# EasyEDA Pro project Summer Robot.eprj, schematic Full Schematic

## Sheets
1 Control System: Create Date: 2025-12-27; Page Name: Control System; Project Name: Summer Robot; Schematic Name: Full Schematic; Update Date: 2026-01-06; Company: EasyEDA.com; Page Size: A4; Version: V1.0
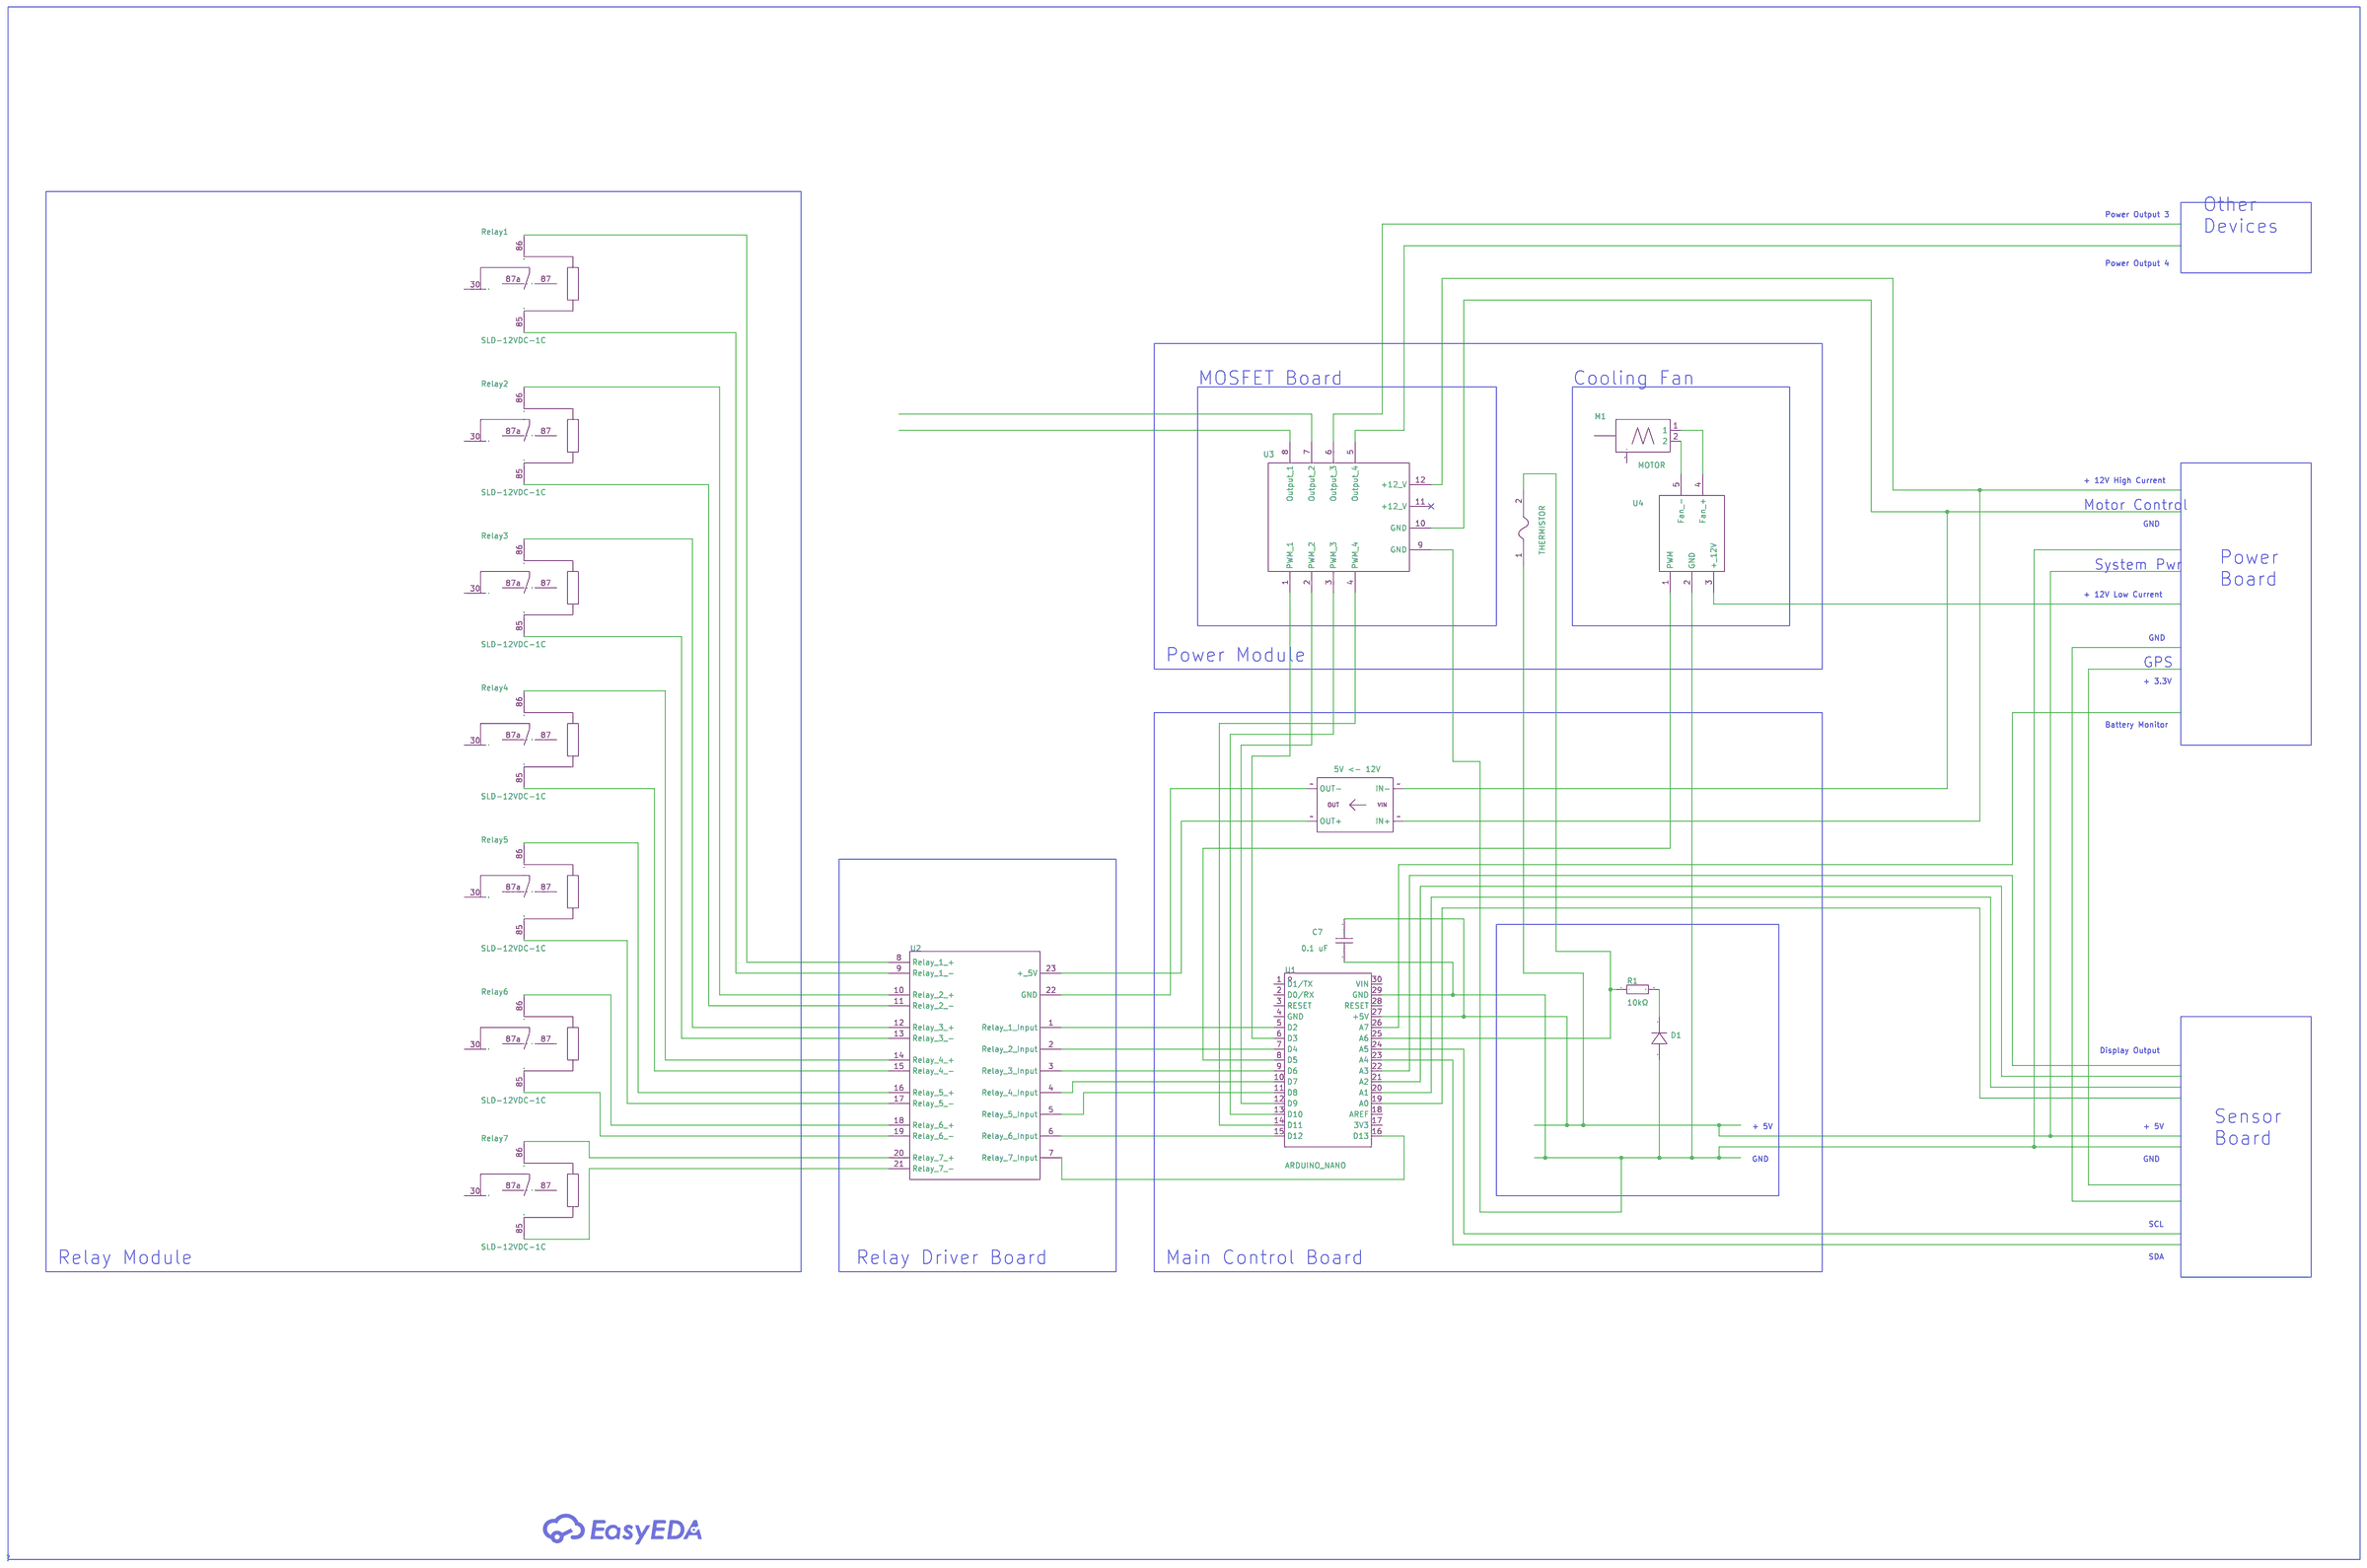
[diagram p4: Control System]
2 Sensor System: Create Date: 2025-12-28; Page Name: Sensor System; Update Date: 2026-06-13
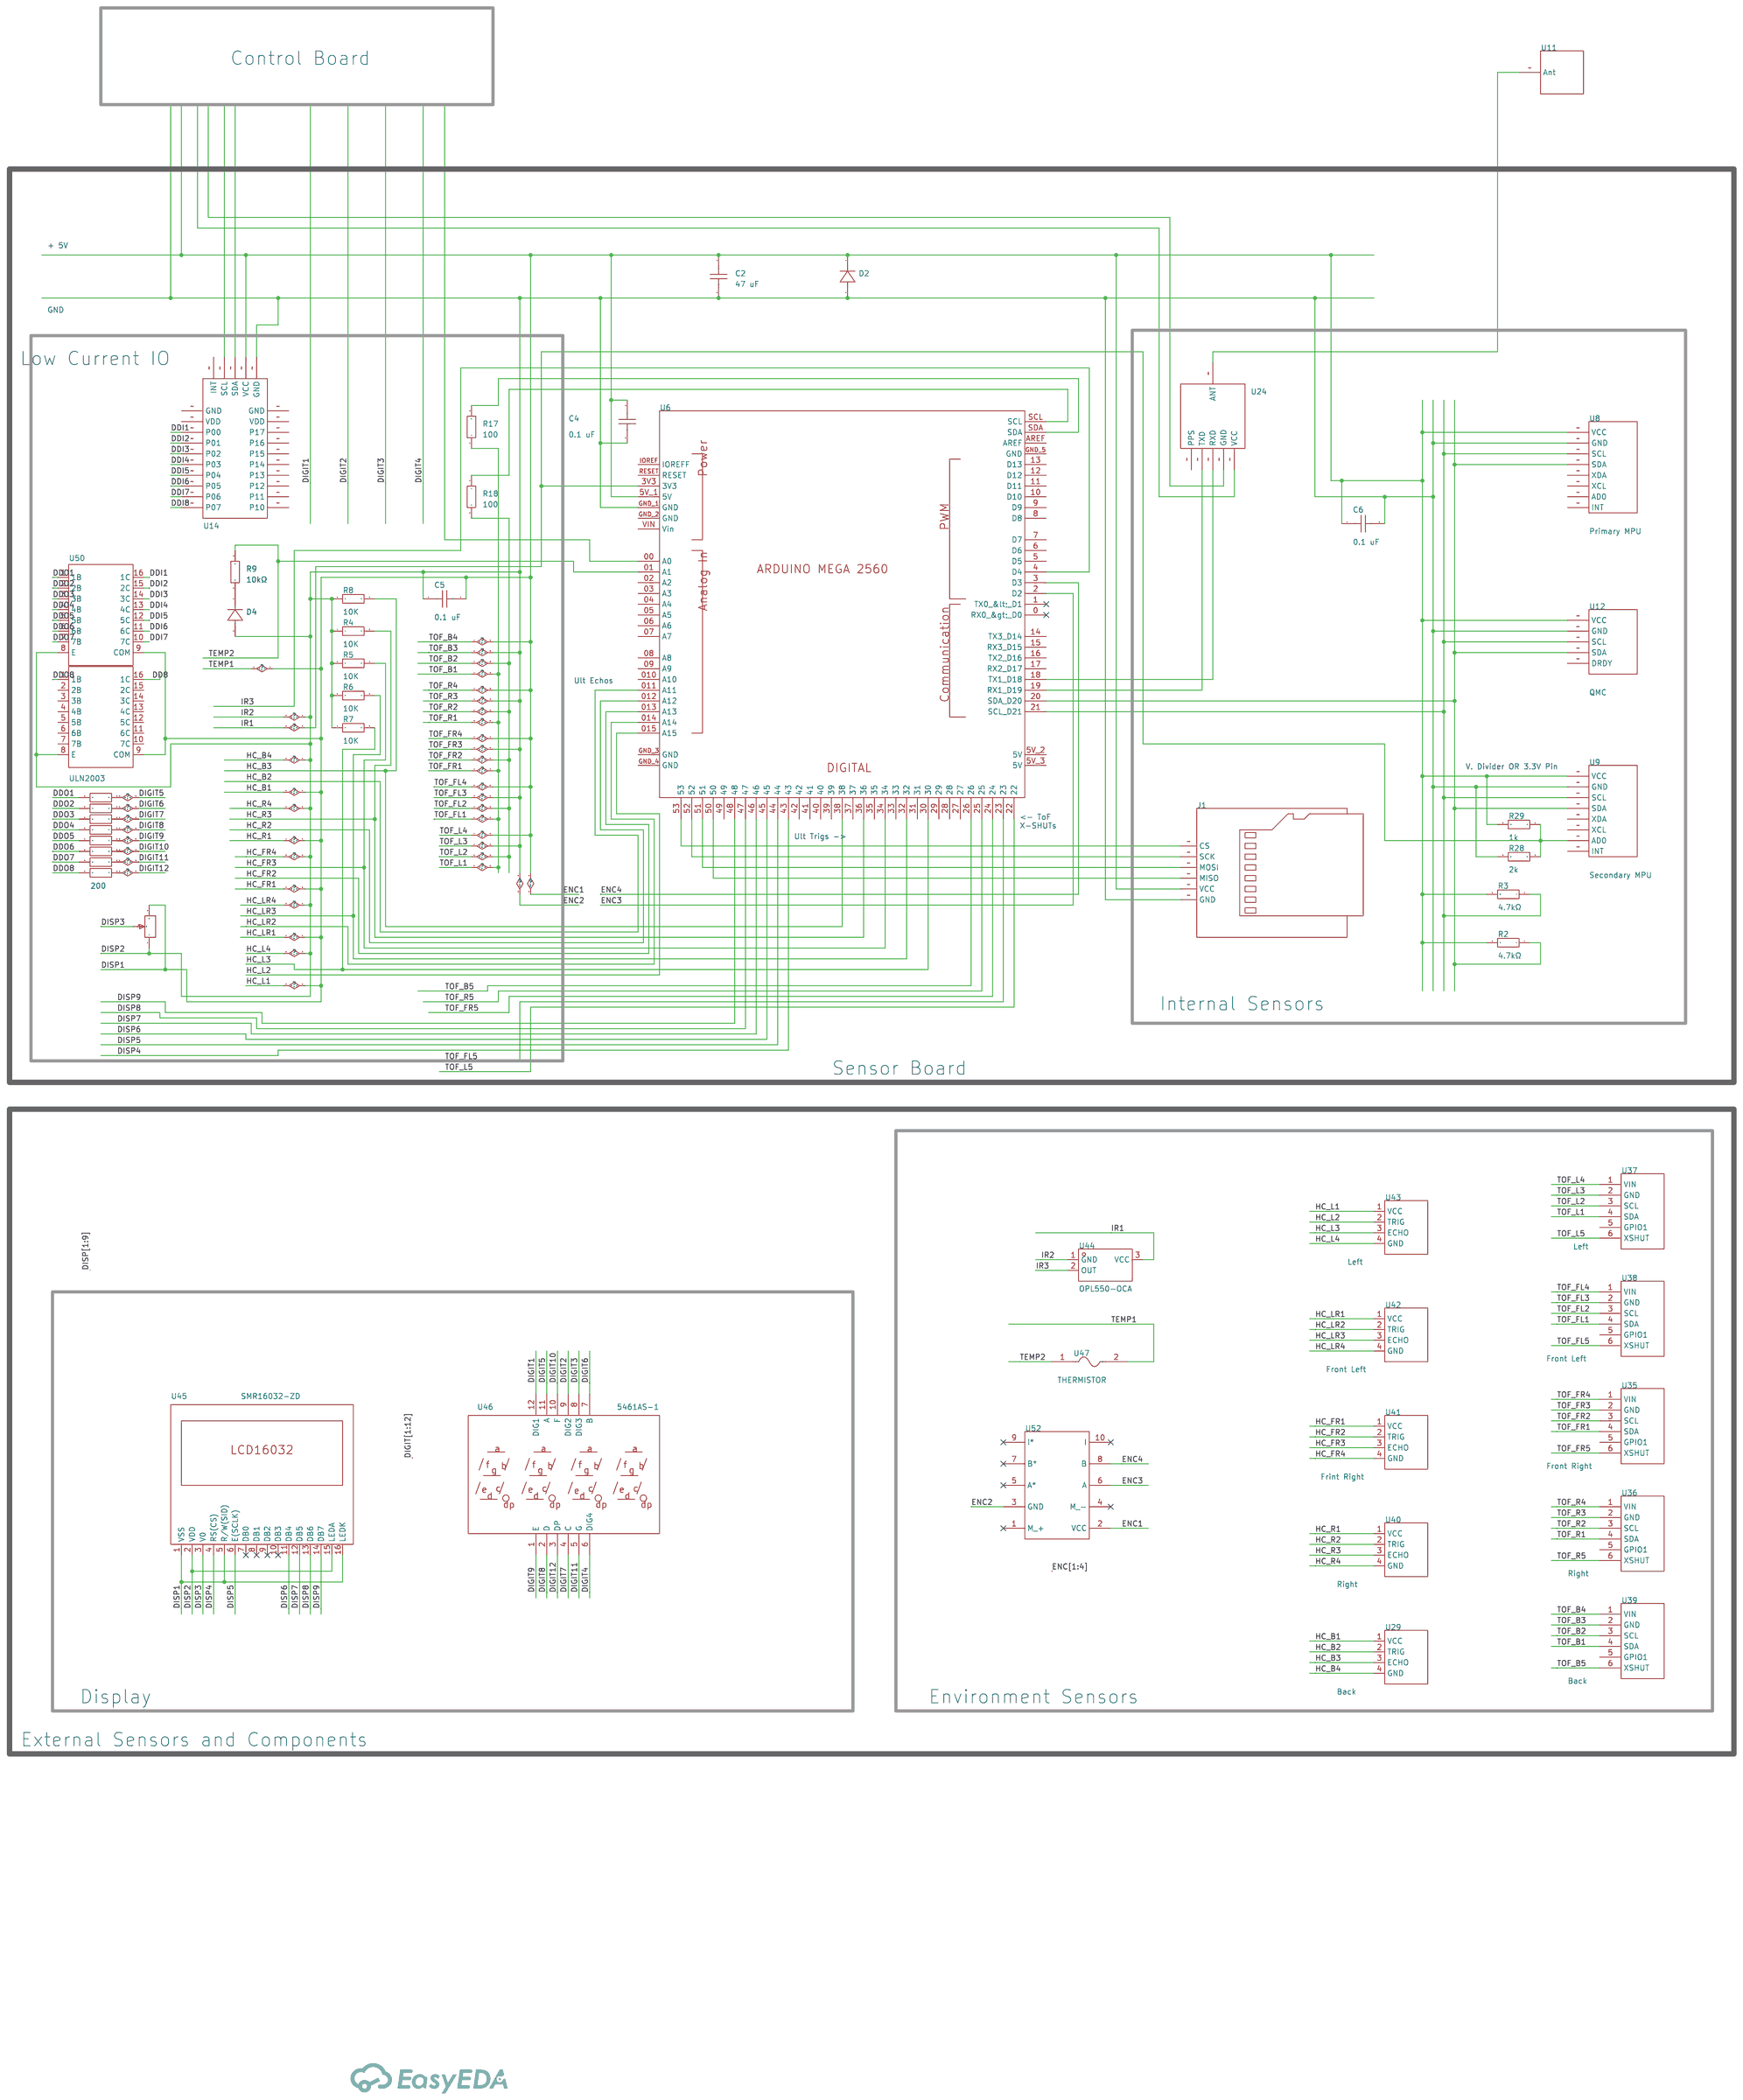
[diagram p5: Sensor System]
3 Power System: Create Date: 2025-12-28; Page Name: Power System; Update Date: 2026-06-14
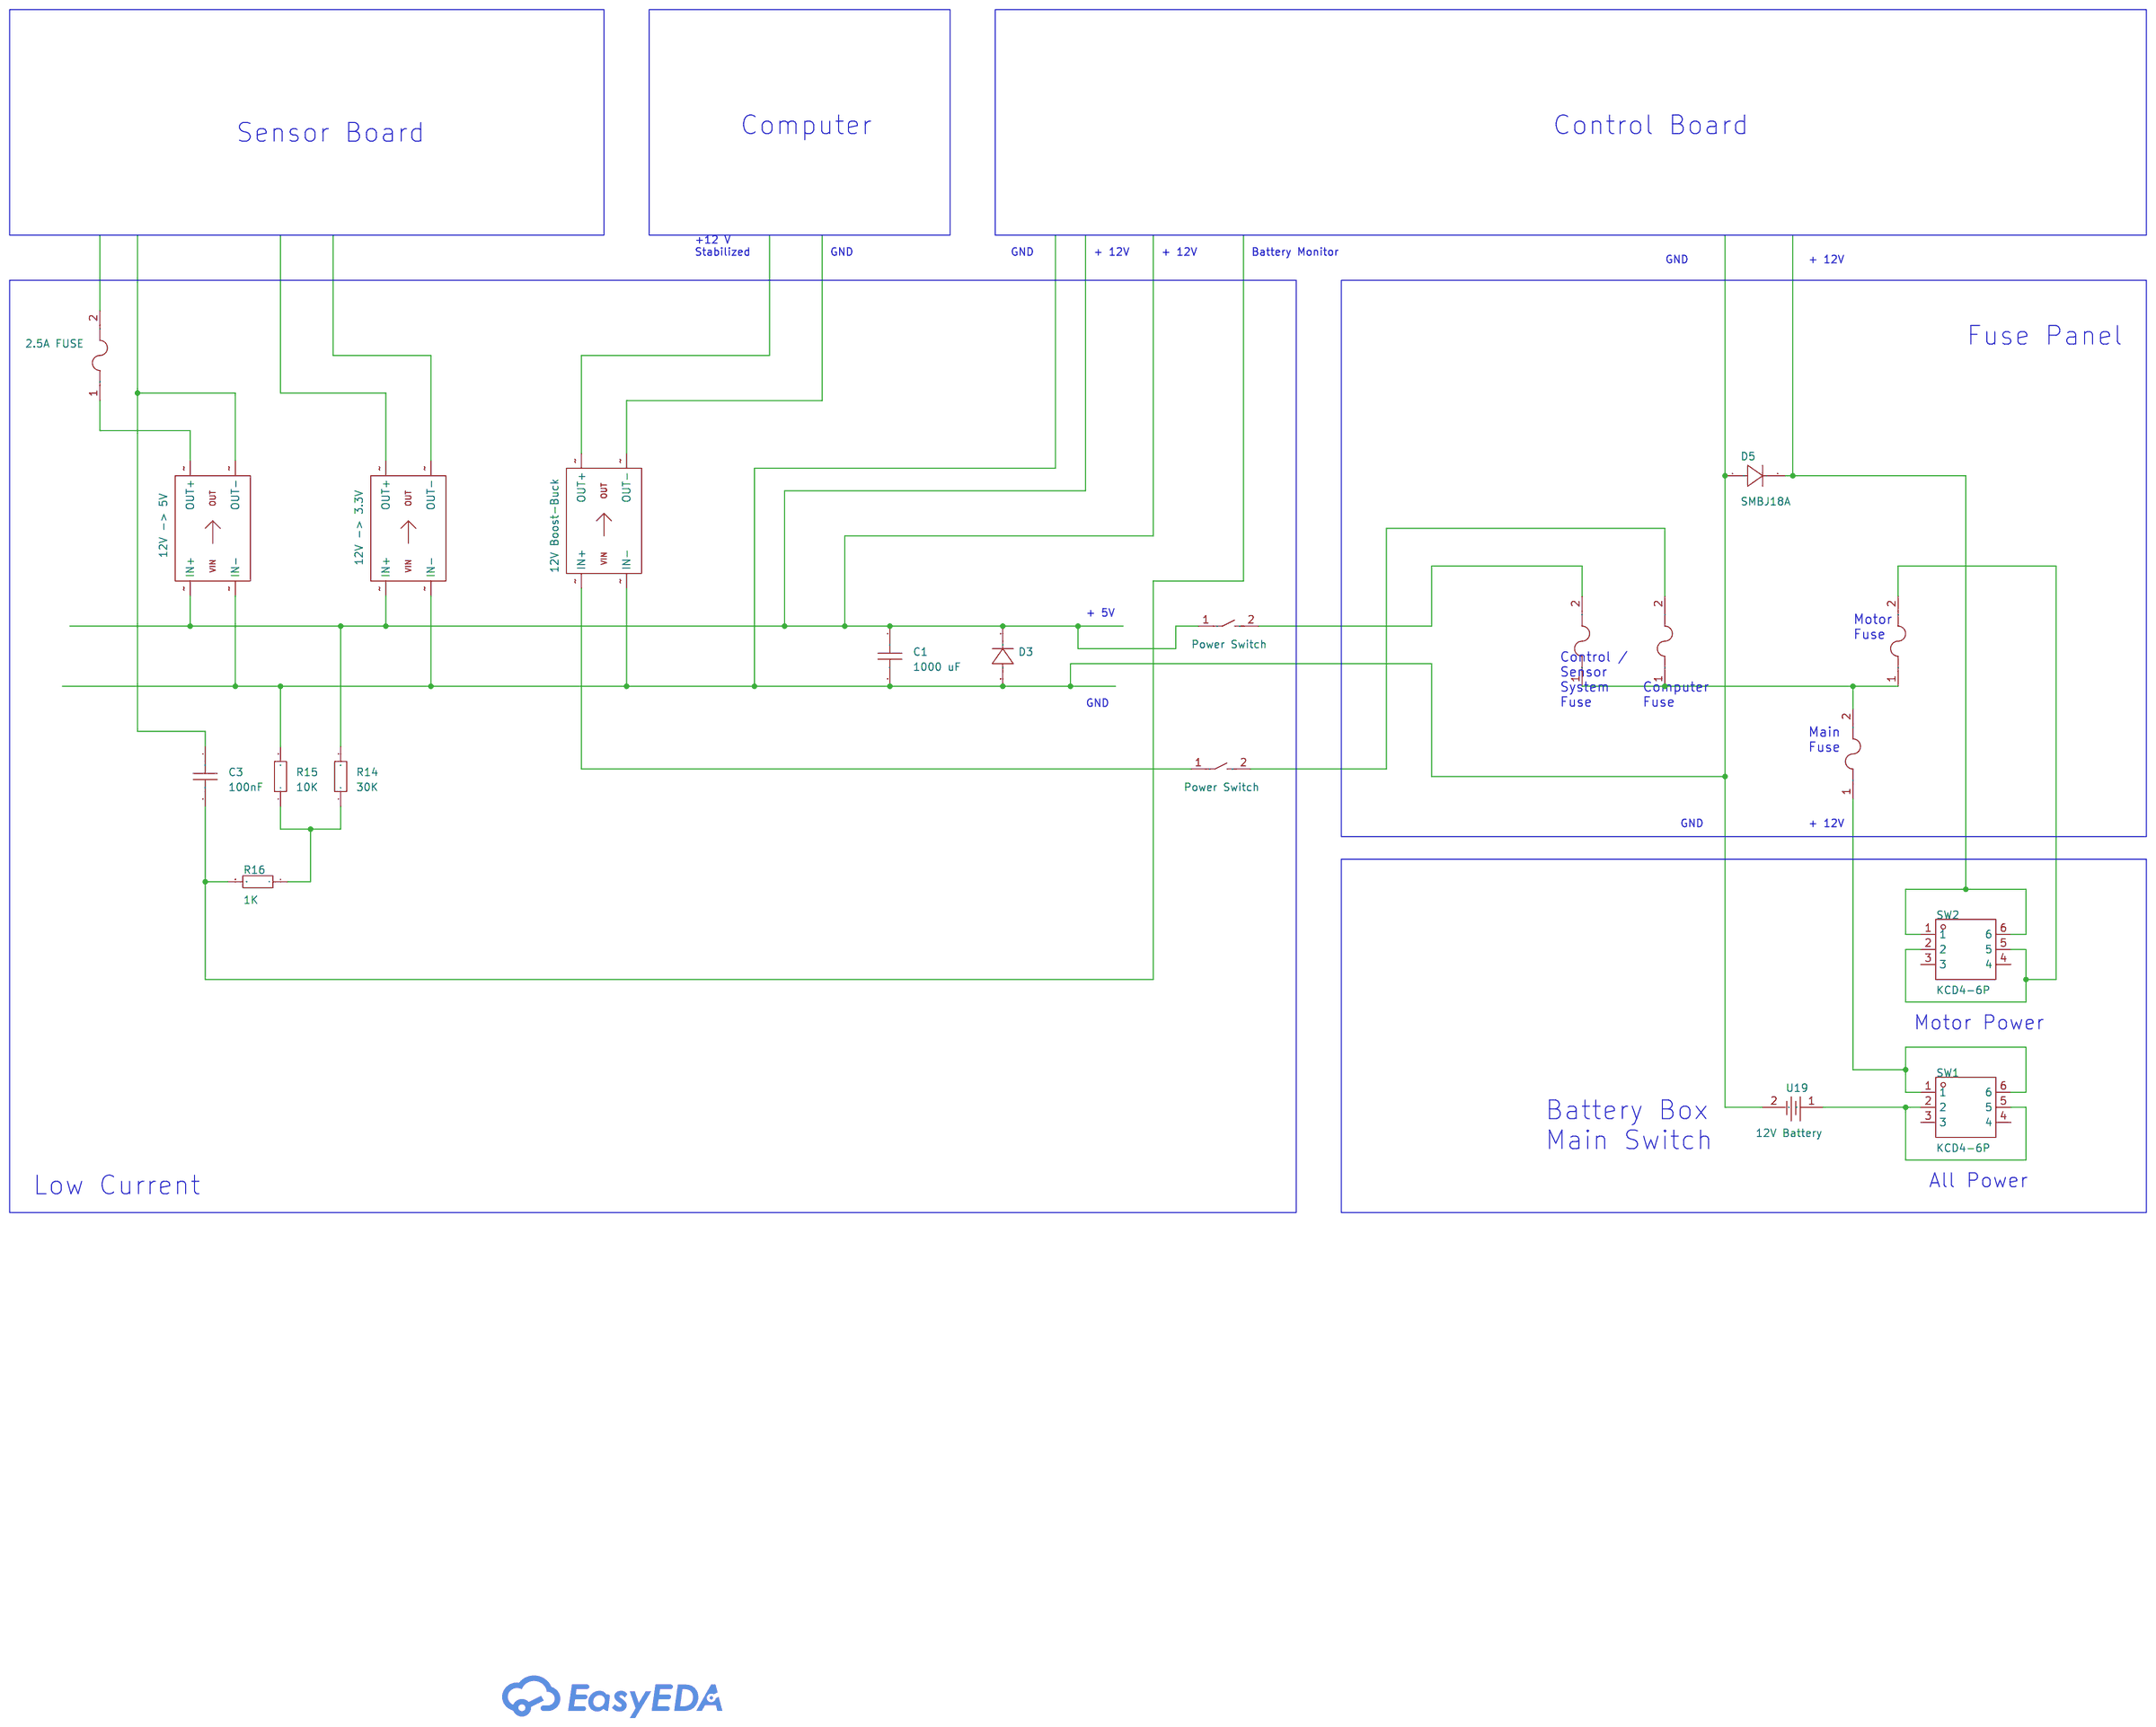
[diagram p6: Power System]
4 Computer: Create Date: 2025-12-28; Page Name: Computer; Update Date: 2025-12-28
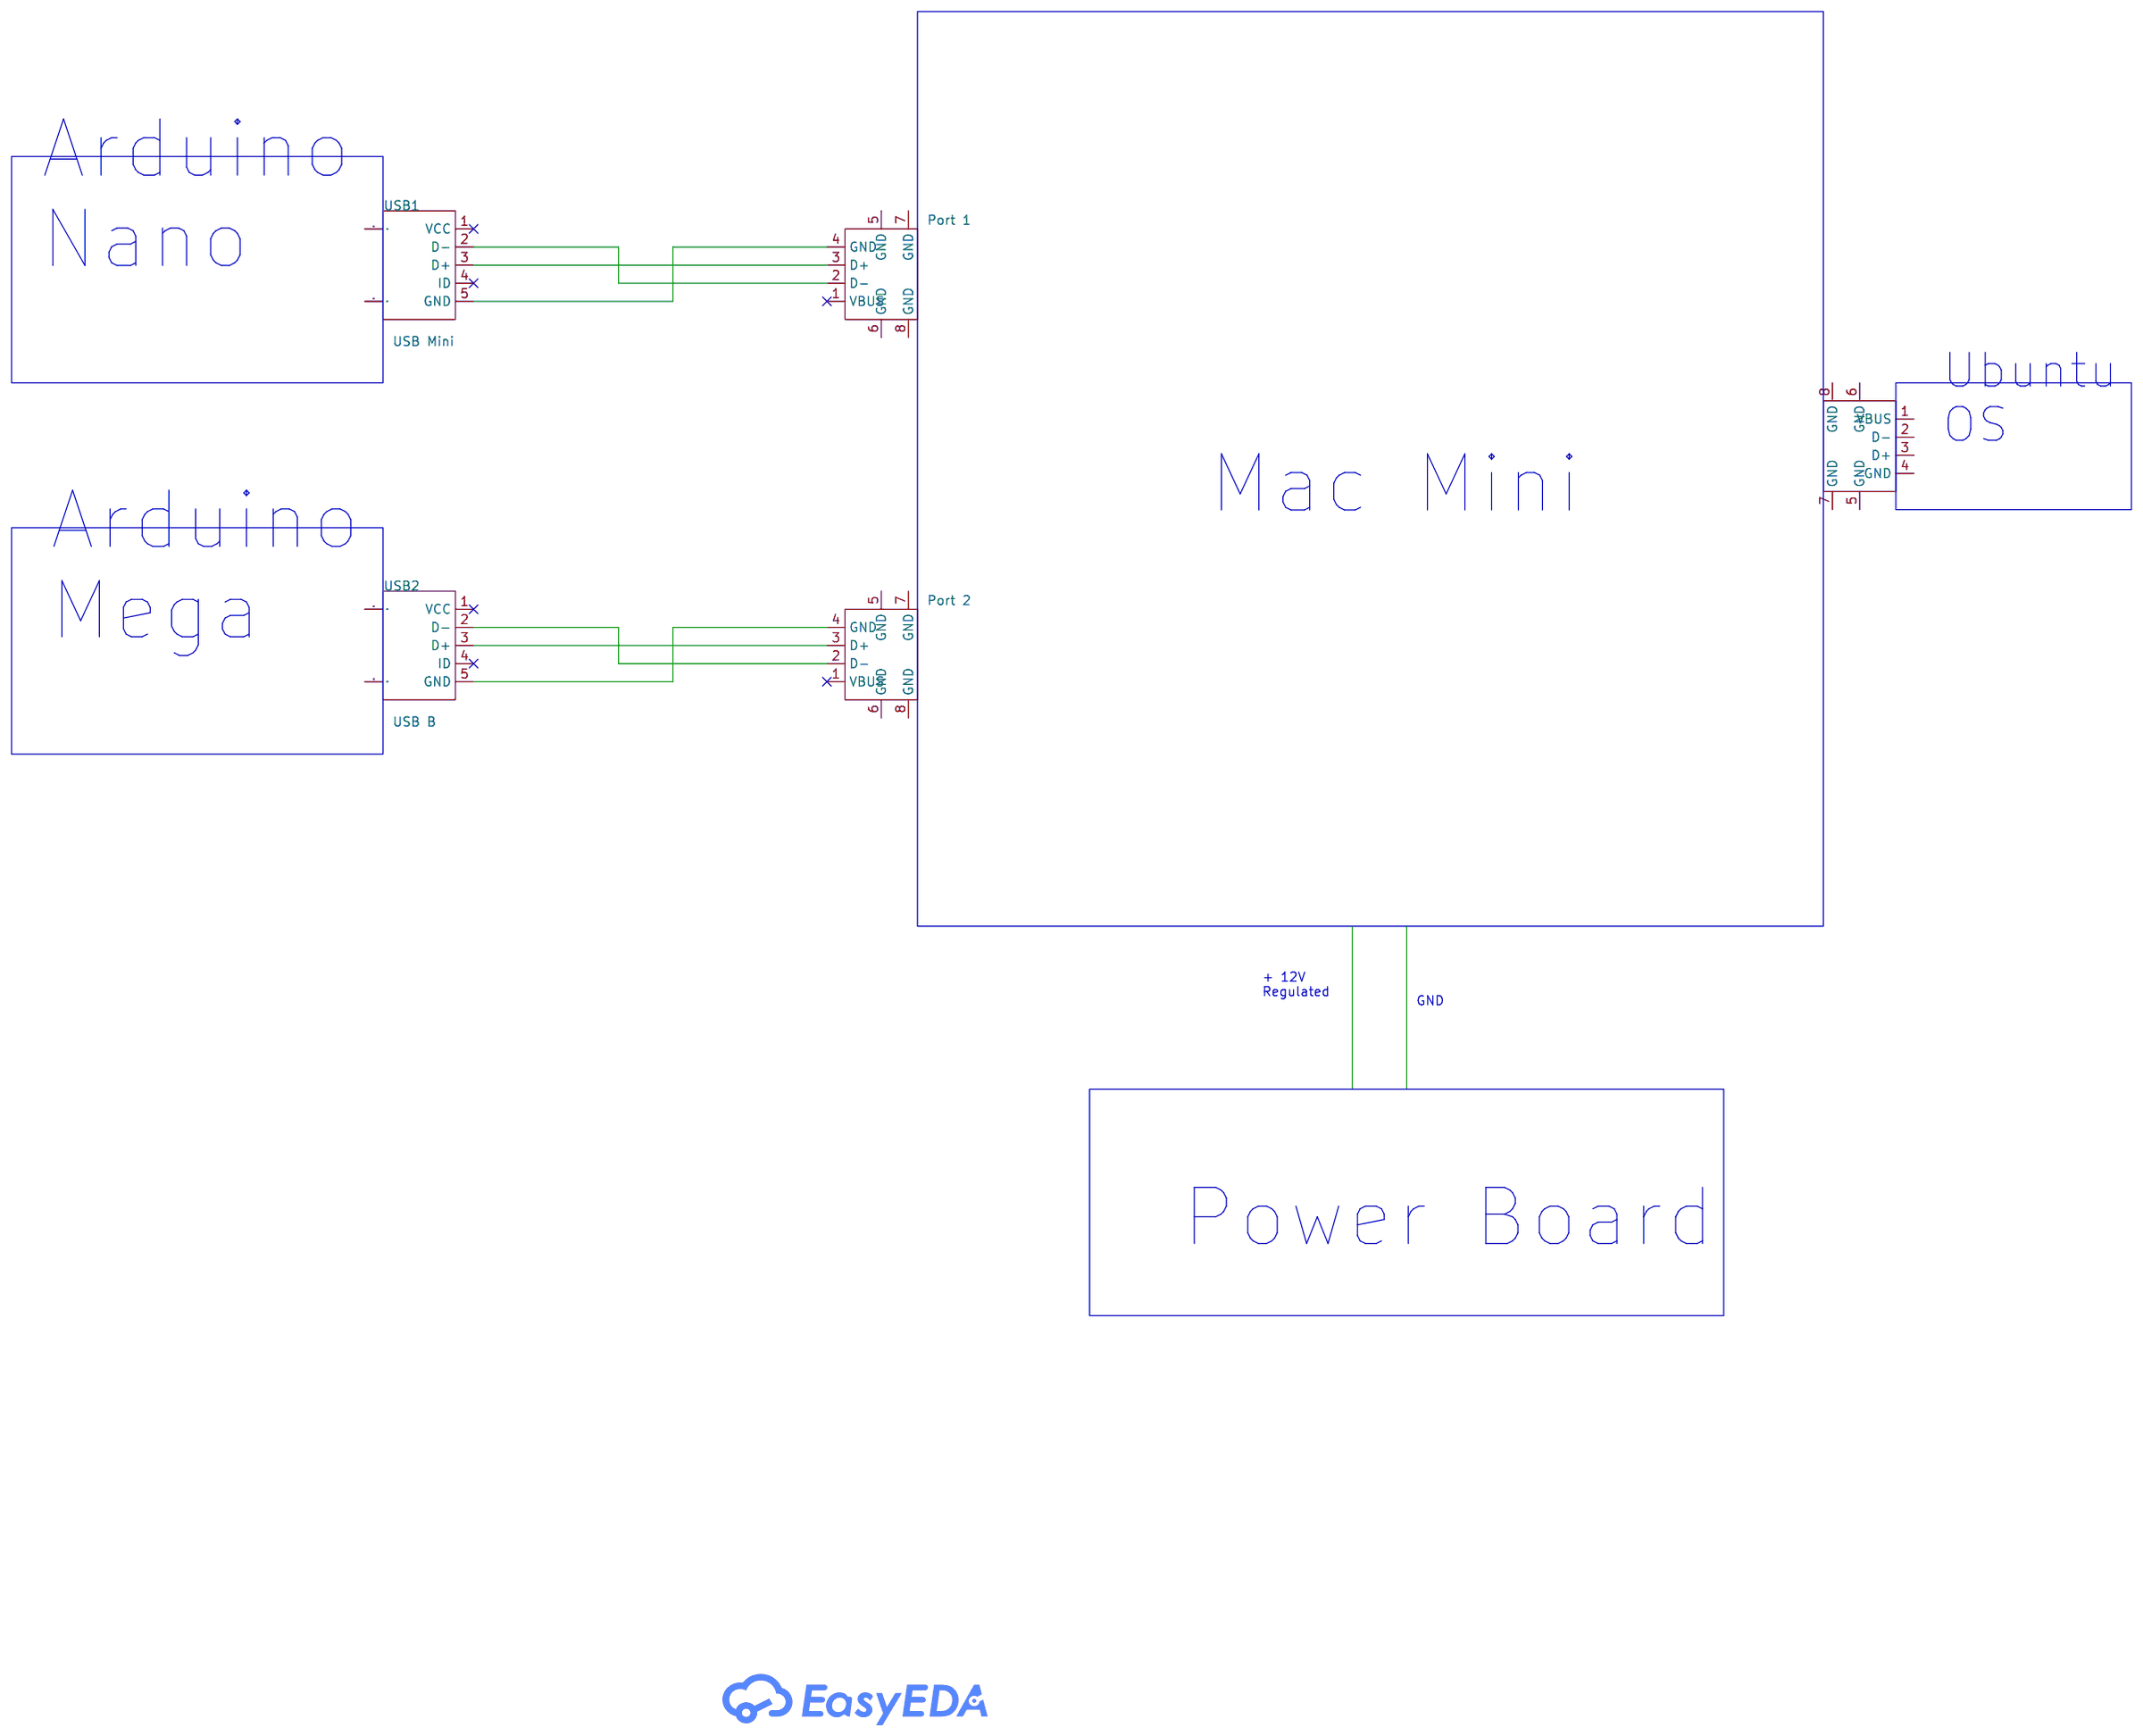
[diagram p7: Computer]

## Parts
sheet Computer
U21  Port 1  [USB-TH_3AR04S-31P0025GS]
U22  Port 2  [USB-TH_3AR04S-31P0025GS]
U23  3AR04S-31P0025GS  [USB-TH_3AR04S-31P0025GS]
USB1  USB Mini  [MINI-USB-SMD_MINI-5PTP]
USB2  USB B  [MINI-USB-SMD_MINI-5PTP]
sheet Control System
C7  0.1 uF  [C0603]
D1  -  [DO-41_BD2.4-L4.7-P8.70-D0.9-RD]
M1  MOTOR  [VIBRATING-MOTOR-SMD_3P_C9900012555]
R1  10kΩ  [RES-TH_BD1.8-L3.2-P7.20-D0.4]
Relay1  SLD-12VDC-1C  [RELAY-TH_SLD-12VDC-1C]
Relay2  SLD-12VDC-1C  [RELAY-TH_SLD-12VDC-1C]
Relay3  SLD-12VDC-1C  [RELAY-TH_SLD-12VDC-1C]
Relay4  SLD-12VDC-1C  [RELAY-TH_SLD-12VDC-1C]
Relay5  SLD-12VDC-1C  [RELAY-TH_SLD-12VDC-1C]
Relay6  SLD-12VDC-1C  [RELAY-TH_SLD-12VDC-1C]
Relay7  SLD-12VDC-1C  [RELAY-TH_SLD-12VDC-1C]
U1  ARDUINO_NANO  [COMM-TH_ARDUINO_NANO]
U2  -
U3  Low Side Power Control
U4  Fan Control
U5  THERMISTOR  [FUSE-SMD_L7.3-W5.1-1]
U7  DC_Step_Down
sheet Power System
C1  1000 uF  [C0603]
C3  100nF  [C0603]
D3  -  [SMA_L4.4-W2.8-LS5.4-RD]
D5  SMBJ18A  [SMB_L4.6-W3.6-LS5.3-RD]
R14  30K  [R0603]
R15  10K  [R0603]
R16  1K  [R0603]
S1  Power Switch  [KEY-SMD_L6.0-W3.5-LS8.0-1]
S2  Power Switch  [KEY-SMD_L6.0-W3.5-LS8.0-1]
SW1  KCD4-6P  [SW-TH_HX-KCD4-6P]
SW2  KCD4-6P  [SW-TH_HX-KCD4-6P]
U15  DC_Step_Down
U16  DC_Step_Down
U17  DC_Step_Down
U19  12V Battery  [BAT-SMD_DIANCHI2]
U53  2.5A FUSE  [FUSE-TH_L7.4-W4.5-P5.10-D0.6-S4.50]
U54  JK250-040U  [FUSE-TH_L7.4-W4.5-P5.10-D0.6-S4.50]
U55  JK250-040U  [FUSE-TH_L7.4-W4.5-P5.10-D0.6-S4.50]
U56  JK250-040U  [FUSE-TH_L7.4-W4.5-P5.10-D0.6-S4.50]
U57  JK250-040U  [FUSE-TH_L7.4-W4.5-P5.10-D0.6-S4.50]
sheet Sensor System
C2  47 uF  [C0603]
C4  0.1 uF  [C0603]
C5  0.1 uF  [C0603]
C6  0.1 uF  [C0603]
D2  -  [SMA_L4.4-W2.8-LS5.4-RD]
D4  -  [DO-41_BD2.4-L4.7-P8.70-D0.9-RD]
J1  Micro_SD_Card_SPI_Adapter
R2  4.7kΩ  [RES-TH_BD1.8-L3.2-P7.20-D0.4]
R3  4.7kΩ  [RES-TH_BD1.8-L3.2-P7.20-D0.4]
R4  10K  [R0603]
R5  10K  [R0603]
R6  10K  [R0603]
R7  10K  [R0603]
R8  10K  [R0603]
R9  10kΩ  [RES-TH_BD1.8-L3.2-P7.20-D0.4]
R17  100  [R0603]
R18  100  [R0603]
R19  200  [R0603]
R21  200  [R0603]
R22  200  [R0603]
R23  200  [R0603]
R24  200  [R0603]
R25  200  [R0603]
R26  200  [R0603]
R27  200  [R0603]
R28  2k  [RES-TH_BD1.8-L3.2-P7.20-D0.4]
R29  1k  [RES-TH_BD1.8-L3.2-P7.20-D0.4]
U6  -
U8  MPU6050
U9  MPU6050
U11  GPS_Ant
U12  QMC5883L
U14  PCF8575
U24  NEO-6M
U29  Back  [TH_HC-SR04V]
U35  Front Right
U36  Right
U37  Left
U38  Front Left
U39  Back
U40  Right  [TH_HC-SR04V]
U41  Frint Right  [TH_HC-SR04V]
U42  Front Left  [TH_HC-SR04V]
U43  Left  [TH_HC-SR04V]
U44  OPL550-OCA  [OPTO-TH_3P-L4.5-W2.4-P1.91-D0.6]
U45  SMR16032-ZD  [LCD-TH_SMR16032-ZD]
U46  5461AS-1  [LED-SEG-TH_12P-L50.4-W19.0-P2.54-S15.24-BL]
U47  THERMISTOR  [FUSE-SMD_L7.3-W5.1-1]
U48  3*3Potentiometer-10kΩ20%  [RES-ADJ-SMD_VG039NCH]
U50  ULN2003  [DIP-16_L19.2-W6.6-P2.54-LS7.6-BL]
U51  ULN2003  [DIP-16_L19.2-W6.6-P2.54-LS7.6-BL]
U52  -

## Library data of the parts
U21-U23 = 3AR04S-31P0025GS: Supplier Part: C9900022698; Supplier Footprint: USB-TH; JLCPCB Part Class: Extended Part; Supplier: LCSC
USB1 USB2 = USBMINIABConnector: Supplier Part: C9900017009; Supplier Footprint: USB_MINI5; JLCPCB Part Class: Extended Part; Supplier: LCSC
C1-C7 = CAP_0603: Supplier Footprint: 0603
D1 D4 = 1N4007: Supplier Footprint: DO-41
M1 = MOTOR_3: Supplier Part: C9900022375; Supplier Footprint: SHOCK_0408; JLCPCB Part Class: Extended Part; Supplier: LCSC
R1-R3 R9 R28 R29 = Res_AXIAL-1/8W: Supplier Footprint: Through
Relay1-Relay7 = SLD-12VDC-1C: Supplier Part: C45053858; Manufacturer: 松乐; Supplier Footprint: 插件; JLCPCB Part Class: Extended Part; Datasheet: https://item.szlcsc.com/datasheet/SLD-12VDC-1C/47146059.html; Supplier: LCSC
U1 = ARDUINO_NANO: Supplier Part: C9900017879; Supplier Footprint: 插件; JLCPCB Part Class: Extended Part; Supplier: LCSC
U2 = Relay Driver
U3 = Motor Control
U4 = Comuter Fan Module
U5 U47 = THERMISTOR_PTC_FUSE_60V_I(H)0.5A_: Supplier Part: C9900023241; Supplier Footprint: FUSE-SMD; JLCPCB Part Class: Extended Part; Supplier: LCSC
U7 U15-U17 = dc_step_down
D2 D3 = 1N4007: Supplier Footprint: SMA(DO-214AC); Supplier Part: C727081
D5 = SMBJ18A_C20883324: Polarity:Unidirectional Reverse Stand-Off Voltage (Vrwm):18V Clamping Voltage:29.2V Peak Pulse Current (Ipp):20.6A Peak Pulse Power Dissipation (Ppp):600W@10/1000us Voltage - Breakdown:22.1V Reverse Leakage Current (Ir):1uA Type:TVS; LCSC Part Name: 单向TVS 18V截止 峰值浪涌电流：20.6A; Supplier Part: C20883324; Manufacturer: OTW(联芯); Supplier Footprint: SMB(DO-214AA); JLCPCB Part Class: Extended Part; Datasheet: https://item.szlcsc.com/datasheet/SMBJ18A/22298784.html; Supplier: LCSC; Polarity: Unidirectional; Reverse Stand-Off Voltage (Vrwm): 18V; Clamping Voltage: 29.2V; Peak Pulse Current (Ipp): 20.6A; Peak Pulse Power Dissipation (Ppp): 600W@10/1000us; Voltage - Breakdown: 22.1V; Reverse Leakage Current (Ir): 1uA; Type: TVS
R4-R8 R14-R19 R21-R27 = Res_0603: Supplier Footprint: 0603
S1 S2 = 02-48-03-0004-00: Supplier Part: C9900014407; Supplier Footprint: SWITCH2-01; JLCPCB Part Class: Extended Part; Supplier: LCSC
SW1 SW2 = KCD4-6P: LCSC Part Name: 25*30.5mm 六脚两档跷板开关 红灯 停产; Supplier Part: C5884424; Manufacturer: SHOU HAN(首韩); Supplier Footprint: 插件,30.5x25mm; JLCPCB Part Class: Extended Part; Datasheet: https://item.szlcsc.com/datasheet/KCD4-6P/6818752.html; Supplier: LCSC; Length: 30.5mm; Width: 25mm; Switch Height: 28.8mm; Actuator Type: Concave Bend; Termination Style: PC Pin; Actuator Color: Red; Current Rating: 16A; Voltage Rating (AC): 250V; Circuit: DPST; Life: 10,000 Cycles; Operating Temperature: 0℃~+125℃; Actuator Identifier: - O
U19 = DIANCHI2: Supplier Part: C9900013521; Supplier Footprint: Battery-3V; JLCPCB Part Class: Extended Part; Supplier: LCSC
U53 = JK250-040U_C9900094733: LCSC Part Name: JK250-040U; Supplier Part: C9900094733; Supplier Footprint: FUSE-TH_L5.8-W3.8-P5.10-D0.8; JLCPCB Part Class: Extended Part; Supplier: LCSC
U54-U57 = JK250-040U_C9900094733: Supplier Part: C9900094733; Supplier Footprint: FUSE-TH_L5.8-W3.8-P5.10-D0.8; JLCPCB Part Class: Extended Part; Supplier: LCSC
J1 = micro_sd_card_spi_adapter
U6 = Arduino Mega
U8 U9 = mpu6050
U11 = gps_ant
U12 = qmc5883l
U14 = pcf8575
U24 = neo-6m
U29 U40-U43 = HC-SR04: Supplier Part: C19857336; Manufacturer: Universal Microelectronics; JLCPCB Part Class: Extended Part; Datasheet: https://item.szlcsc.com/datasheet/HC-SR04/21184790.html; Supplier: LCSC
U35-U39 = VL53L0X
U44 = OPL550-OCA: Operating Temperature:-40℃~+85℃ Operating Temperature:-40℃~+85℃; Supplier Part: C17588768; Manufacturer: OPTEK; Datasheet: https://atta.szlcsc.com/upload/public/pdf/source/231023/C17209350-828dfa6ff885da0cb8ecd96d3e585cf7.pdf; Supplier: LCSC; Operating Temperature: -40℃~+85℃
U45 = SMR16032-ZD: Supplier Part: C9900249207; Supplier Footprint: LCD16032; Supplier: LCSC
U46 = 5461AS-1: Supplier Part: C9900039509; Supplier Footprint: 0.56-inch; Supplier: LCSC
U48 = 3*3Potentiometer-10kΩ20%: Supplier Part: C9900010776; Supplier Footprint: SMD-3P; JLCPCB Part Class: Extended Part; Supplier: LCSC
U50 U51 = ULN2003_C6851442: number of channels:Seven channels Maximum collector Emitter Voltage (Vceo):50V Collector Current(Ic):- maximum input voltage:30V Operating Temperature:- Operating Temperature:-; LCSC Part Name: 七路 Vceo: 50V 电压(VI): 30V; Supplier Part: C6851442; Manufacturer: HXY MOSFET(华轩阳电子); Supplier Footprint: SOP-16; JLCPCB Part Class: Extended Part; Datasheet: https://atta.szlcsc.com/upload/public/pdf/source/20230526/BF18AFD4628411B197E7B7E814422353.pdf; Supplier: LCSC; number of channels: Seven channels; Maximum collector Emitter Voltage (Vceo): 50V; maximum input voltage: 30V
U52 = Maxon Encoder

## Nets
DD8: U51.16(1C)
DDI1: C2.1 C2.2 C4.1 C4.2 C5.1 C5.2 C6.1 C6.2 D2.1(K) D2.2(A) D4.2(A) J1.~(VCC) R2.1 R2.2 R3.1 R3.2 R4.1 R5.1 R6.1 R7.1 R8.1 R28.1 R28.2 R29.1 R29.2 U6.3V3 U6.5V_1(5V) U6.20(SDA D20) U6.21(SCL D21) U6.50 U6.51 U6.52 U6.53 U6.GND_1(GND) U8.~(XDA) U9.~(XDA) U12.~(VCC) U14.~(VDD) U29.1(VCC) U29.4(GND) U35.1(VIN) U35.2(GND) U36.1(VIN) U36.2(GND) U37.1(VIN) U37.2(GND) U38.1(VIN) U38.2(GND) U39.1(VIN) U39.2(GND) U40.1(VCC) U40.4(GND) U41.1(VCC) U41.4(GND) U42.1(VCC) U42.4(GND) U43.1(VCC) U43.4(GND) U44.1(GND) U44.3(VCC) U45.1(VSS) U45.2(VDD) U45.5(R/W(SID)) U45.15(LEDA) U45.16(LEDK) U47.2 U48.1 U48.3 U50.8(E) U50.9(COM) U50.10(7C) U50.11(6C) U50.12(5C) U50.13(4C) U50.14(3C) U50.15(2C) U50.16(1C) U51.8(E) U51.9(COM) U52.2(VCC) U52.3(GND)
DDO1: R19.1 U50.1(1B)
DDO2: R27.1 U50.2(2B)
DDO3: R21.1 U50.3(3B)
DDO4: R22.1 U50.4(4B)
DDO5: R23.1 U50.5(5B)
DDO6: R24.1 U50.6(6B)
DDO7: R25.1 U50.7(7B)
DDO8: R26.1 U51.1(1B)
DIGIT1: U46.12(DIG1)
DIGIT2: U46.9(DIG2)
DIGIT3: U46.8(DIG3)
DIGIT4: U46.6(DIG4)
DIGIT5: R19.2 U46.11(A)
DIGIT6: R27.2 U46.7(B)
DIGIT7: R21.2 U46.4(C)
DIGIT8: R22.2 U46.2(D)
DIGIT9: R23.2 U46.1(E)
DIGIT10: R24.2 U46.10(F)
DIGIT11: R25.2 U46.5(G)
DIGIT12: R26.2 U46.3(DP)
DISP3: U45.3(V0) U48.2
DISP4: U6.43 U45.4(RS(CS))
DISP5: U6.44 U45.6(E(SCLK))
DISP6: U6.45 U45.11(DB4)
DISP7: U6.46 U45.12(DB5)
DISP8: U6.47 U45.13(DB6)
DISP9: U6.48 U45.14(DB7)
ENC3: U6.2(D2) U52.6(A)
ENC4: U6.3(D3) U52.8(B)
HC_B2: U6.011(A11) U29.2(TRIG)
HC_B3: R8.2 U6.38 U29.3(ECHO)
HC_FR2: U6.013(A13) U41.2(TRIG)
HC_FR3: R5.2 U6.34 U41.3(ECHO)
HC_L2: U6.015(A15) U43.2(TRIG)
HC_L3: R7.2 U6.30 U43.3(ECHO)
HC_LR2: U6.014(A14) U42.2(TRIG)
HC_LR3: R6.2 U6.32 U42.3(ECHO)
HC_R2: U6.012(A12) U40.2(TRIG)
HC_R3: R4.2 U6.36 U40.3(ECHO)
IR3: U6.4(D4) U44.2(OUT)
TEMP2: R9.2 U6.01(A1) U47.1
TOF_B1: R17.1 U35.4(SDA) U36.4(SDA) U37.4(SDA) U38.4(SDA) U39.4(SDA)
TOF_B2: R18.2 U35.3(SCL) U36.3(SCL) U37.3(SCL) U38.3(SCL) U39.3(SCL)
TOF_B5: U6.26 U39.6(XSHUT)
TOF_FL5: U6.23 U38.6(XSHUT)
TOF_FR5: U6.24 U35.6(XSHUT)
TOF_L5: U6.22 U37.6(XSHUT)
TOF_R5: U6.25 U36.6(XSHUT)
Net-(C1-1): C1.1 C1.2 C3.1 D3.1(K) D3.2(A) D5.2(A) R14.2 R15.2 S1.1 S2.1 U15.~(OUT-) U16.~(OUT-) U17.~(OUT-) U19.2 U53.1
Net-(C3-2): C3.2 R16.2
Net-(C7-1): C7.1 U1.27(+5V) U5.1
Net-(C7-2): C7.2 D1.2(A) U1.29(GND) U3.9(GND) U4.2(GND)
Net-(D1-1): D1.1(K) R1.2
Net-(D4-1): D4.1(K) R9.1
Net-(D5-1): D5.1(K) SW2.1 SW2.6
Net-(M1-1): M1.1 U4.4(Fan +)
Net-(M1-2): M1.2 U4.5(Fan -)
Net-(R1-1): R1.1 U1.25(A6) U5.2
Net-(R14-1): R14.1 R15.1 R16.1
Net-(R17-2): R17.2 U6.SDA
Net-(R18-1): R18.1 U6.SCL
Net-(Relay1-85): Relay1.85 U2.9(Relay 1 -)
Net-(Relay1-86): Relay1.86 U2.8(Relay 1 +)
Net-(Relay2-85): Relay2.85 U2.11(Relay 2 -)
Net-(Relay2-86): Relay2.86 U2.10(Relay 2 +)
Net-(Relay3-85): Relay3.85 U2.13(Relay 3 -)
Net-(Relay3-86): Relay3.86 U2.12(Relay 3 +)
Net-(Relay4-85): Relay4.85 U2.15(Relay 4 -)
Net-(Relay4-86): Relay4.86 U2.14(Relay 4 +)
Net-(Relay5-85): Relay5.85 U2.17(Relay 5 -)
Net-(Relay5-86): Relay5.86 U2.16(Relay 5 +)
Net-(Relay6-85): Relay6.85 U2.19(Relay 6 -)
Net-(Relay6-86): Relay6.86 U2.18(Relay 6 +)
Net-(Relay7-85): Relay7.85 U2.21(Relay 7 -)
Net-(Relay7-86): Relay7.86 U2.20(Relay 7 +)
Net-(S1-2): S1.2 U57.2
Net-(S2-2): S2.2 U56.2
Net-(SW1-1): SW1.1 SW1.6 U54.1
Net-(SW1-2): SW1.2 SW1.5 U19.1
Net-(SW2-2): SW2.2 SW2.5 U55.2
Net-(U1-5): U1.5(D2) U2.1(Relay 1 Input)
Net-(U1-6): U1.6(D3) U3.1(PWM 1)
Net-(U1-7): U1.7(D4) U2.2(Relay 2 Input)
Net-(U1-8): U1.8(D5) U4.1(PWM)
Net-(U1-9): U1.9(D6) U2.3(Relay 3 Input)
Net-(U1-10): U1.10(D7) U2.4(Relay 4 Input)
Net-(U1-11): U1.11(D8) U2.5(Relay 5 Input)
Net-(U1-12): U1.12(D9) U3.2(PWM 2)
Net-(U1-13): U1.13(D10) U3.3(PWM 3)
Net-(U1-14): U1.14(D11) U3.4(PWM 4)
Net-(U1-15): U1.15(D12) U2.6(Relay 6 Input)
Net-(U1-16): U1.16(D13) U2.7(Relay 7 Input)
Net-(U2-22): U2.22(GND) U2.23(+ 5V) U3.10(GND) U3.12(+12 V) U7.~(OUT-)
Net-(U6-18): U6.18(TX1 D18) U6.19(RX1 D19) U11.~(Ant) U24.~(VCC)
Net-(U21-2): U21.2(D-) USB1.2(D-)
Net-(U21-3): U21.3(D+) USB1.3(D+)
Net-(U21-4): U21.4(GND) USB1.5(GND)
Net-(U22-2): U22.2(D-) USB2.2(D-)
Net-(U22-3): U22.3(D+) USB2.3(D+)
Net-(U22-4): U22.4(GND) USB2.5(GND)
Net-(U54-2): U54.2 U55.1 U56.1 U57.1
Net-(USB1-6): USB1.6 USB1.9
Net-(USB1-7): USB1.7 USB1.8
Net-(USB2-6): USB2.6 USB2.9
Net-(USB2-7): USB2.7 USB2.8

Not connected (* = marked no-connect by the designer): M1 3; Relay1 30 87 87a; Relay2 30 87 87a; Relay3 30 87 87a; Relay4 30 87 87a; Relay5 30 87 87a; Relay6 30 87 87a; Relay7 30 87 87a; SW1 3 4; SW2 3 4; U1 1(D1/TX) 2(D0/RX) 3(RESET) 4(GND) 17(3V3) 18(AREF) 19(A0) 20(A1) 21(A2) 22(A3) 23(A4) 24(A5) 26(A7) 28(RESET) 30(VIN); U3 5(Output 4) 6(Output 3) 7(Output 2) 8(Output 1) 11(+12 V)*; U4 3(+ 12V); U6 00(A0) 0(RX0 &gt; D0)* 1(TX0 &lt; D1)* 02(A2) 03(A3) 04(A4) 05(A5) 5(D5) 5V_2(5V) 5V_3(5V) 06(A6) 6(D6) 07(A7) 7(D7) 08(A8) 8(D8) 09(A9) 9(D9) 010(A10) 10(D10) 11(D11) 12(D12) 13(D13) 14(TX3 D14) 15(RX3 D15) 16(TX2 D16) 17(RX2 D17) 27 28 29 31 33 35 37 39 40 41 42 49 AREF GND_2(GND) GND_3(GND) GND_4(GND) GND_5(GND) IOREF(IOREFF) RESET VIN(Vin); U21 1(VBUS)* 5(GND) 6(GND) 7(GND) 8(GND); U22 1(VBUS)* 5(GND) 6(GND) 7(GND) 8(GND); U23 1(VBUS) 2(D-) 3(D+) 4(GND) 5(GND) 6(GND) 7(GND) 8(GND); U35 5(GPIO1); U36 5(GPIO1); U37 5(GPIO1); U38 5(GPIO1); U39 5(GPIO1); U45 7(DB0)* 8(DB1)* 9(DB2)* 10(DB3)*; U51 2(2B) 3(3B) 4(4B) 5(5B) 6(6B) 7(7B) 10(7C) 11(6C) 12(5C) 13(4C) 14(3C) 15(2C); U52 1(M +)* 4(M -)* 5(A*)* 7(B*)* 9(I*)* 10(I)*; U53 2; USB1 1(VCC)* 4(ID)*; USB2 1(VCC)* 4(ID)*

## Notes on the sheets
sheet 1
- Power Output 3
- Other
  Devices
- Power Output 4
- MOSFET Board
- Cooling Fan
- + 12V High Current
- Motor Control
- GND
- System Pwr
- Power
  Board
- + 12V Low Current
- GND
- Power Module
- GPS
- + 3.3V
- Battery Monitor
- Display Output
- + 5V
- + 5V
- Sensor
  Board
- GND
- GND
- SCL
- Relay Module
- Relay Driver Board
- Main Control Board
- SDA
sheet 2
- Control Board
- + 5V
- GND
- Low Current IO
- Ult Echos
- V. Divider OR 3.3V Pin
- <- ToF
  X-SHUTs
- Ult Trigs ->
- Internal Sensors
- Sensor Board
- Display
- Environment Sensors
- External Sensors and Components
sheet 3
- Computer
- Control Board
- Sensor Board
- +12 V
  Stabilized
- GND
- GND
- + 12V
- + 12V
- Battery Monitor
- GND
- + 12V
- Fuse Panel
- + 5V
- Motor
  Fuse
- GND
- Control /
  Sensor
  System
  Fuse
- Computer
  Fuse
- Main
  Fuse
- GND
- + 12V
- Motor Power
- Battery Box
  Main Switch
- All Power
- Low Current
sheet 4
- Arduino
  Nano
- Ubuntu
  OS
- Mac Mini
- Arduino
  Mega
- + 12V
  Regulated
- GND
- Power Board
